# Altium schematic sheet Sheet1.SchDoc
size A4
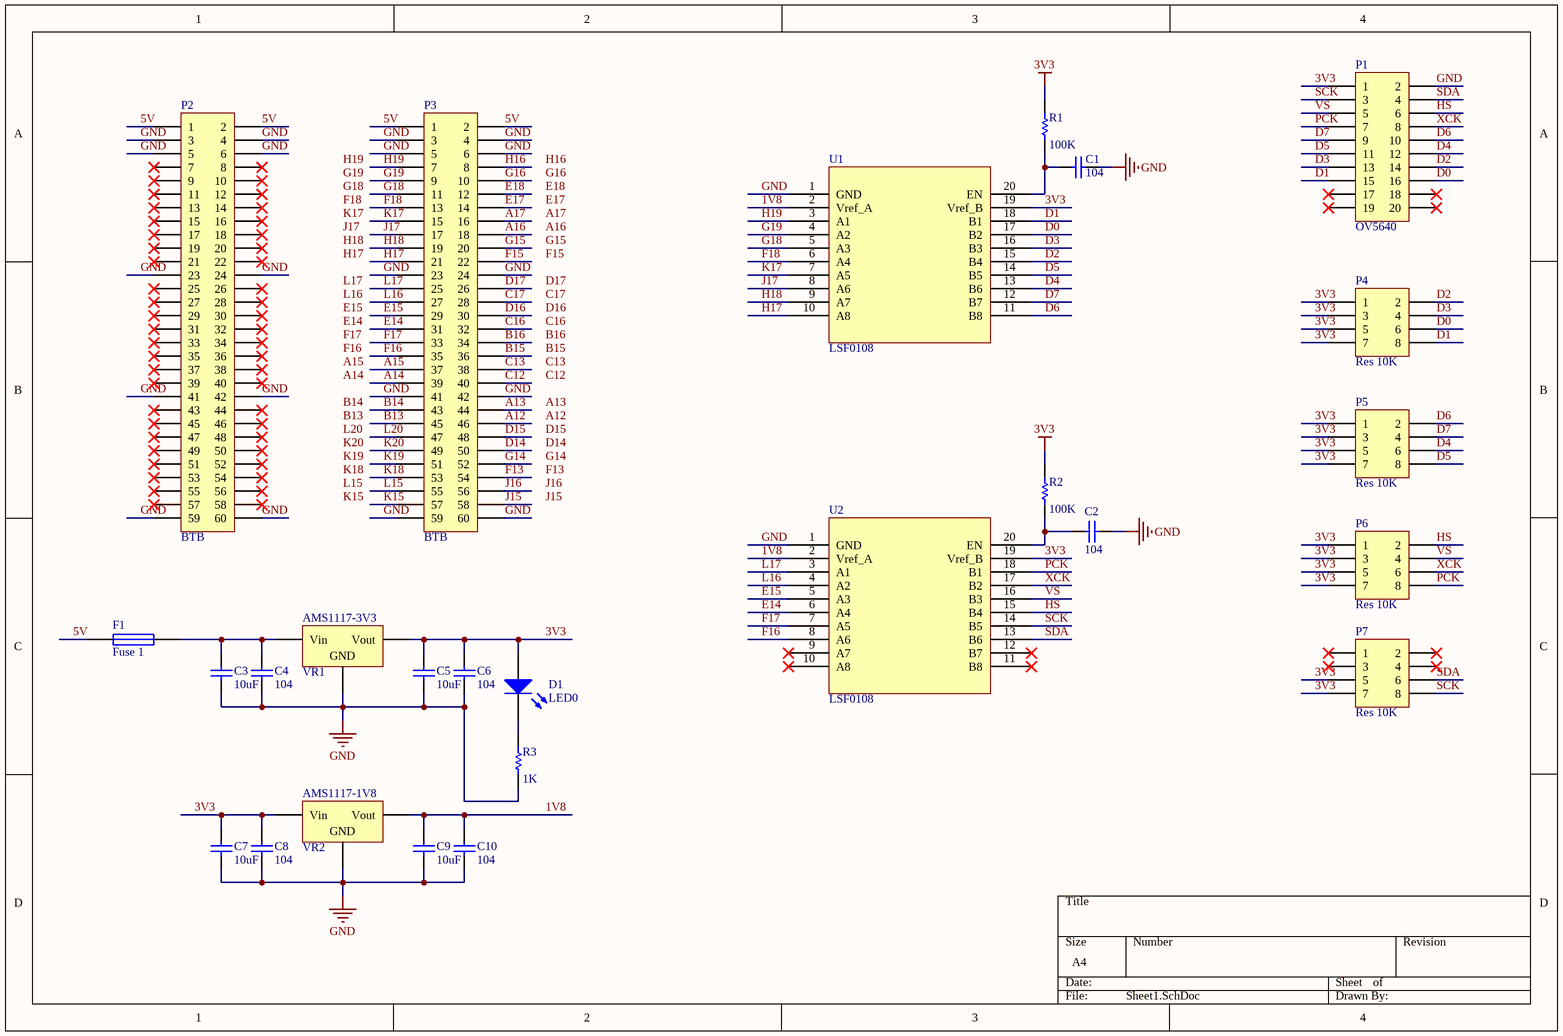
[diagram p0: Sheet1.SchDoc]

## Parts
C1  value 104  [R0805]  (hidden comment: Cap)
C2  value 104  [R0805]  (hidden comment: Cap)
C3  value 10uF  [R0805]  (hidden comment: Cap)
C4  value 104  [R0805]  (hidden comment: Cap)
C5  value 10uF  [R0805]  (hidden comment: Cap)
C6  value 104  [R0805]  (hidden comment: Cap)
C7  value 10uF  [R0805]  (hidden comment: Cap)
C8  value 104  [R0805]  (hidden comment: Cap)
C9  value 10uF  [R0805]  (hidden comment: Cap)
C10  value 104  [R0805]  (hidden comment: Cap)
D1  LED0  [LED0805红]
F1  Fuse 1  [R0805]
P1  OV5640  [HDR2X10]
P2  BTB  [BTBCON_0.8mm_60P]
P3  BTB  [BTBCON_0.8mm_60P]
P4  Res 10K  [排阻(4位贴片)]
P5  Res 10K  [排阻(4位贴片)]
P6  Res 10K  [排阻(4位贴片)]
P7  Res 10K  [排阻(4位贴片)]
R1  value 100K  [R0805]  (hidden comment: Res Semi)
R2  value 100K  [R0805]  (hidden comment: Res Semi)
R3  value 1K  [R0805]  (hidden comment: Res1)
U1  LSF0108  [TSSOP20 74lvc245]
U2  LSF0108  [TSSOP20 74lvc245]
VR1  AMS1117-3V3  [SOT-223]
VR2  AMS1117-1V8  [SOT-223]

## Nets
3V3: C5.2 C6.2 C7.2 C8.2 D1.1(A) P1.1 P4.1 P4.3 P4.5 P4.7 P5.1 P5.3 P5.5 P5.7 P6.1 P6.3 P6.5 P6.7 P7.5 P7.7 R1.2 R2.2 U1.19(Vref_B) U2.19(Vref_B) VR1.2(Vout) VR2.3(Vin)
GND: C1.2 C2.1 C3.1 C4.1 C5.1 C6.1 C7.1 C8.1 C9.1 C10.1 P1.2 P2.3 P2.4 P2.5 P2.6 P2.23 P2.24 P2.41 P2.42 P2.59 P2.60 P3.3 P3.4 P3.5 P3.6 P3.23 P3.24 P3.41 P3.42 P3.59 P3.60 R3.1 U1.1(GND) U2.1(GND) VR1.1(GND) VR2.1(GND)
1V8: C9.2 C10.2 U1.2(Vref_A) U2.2(Vref_A) VR2.2(Vout)
5V: F1.1 P2.1 P2.2 P3.1 P3.2
A12: P3.46
A13: P3.44
A14: P3.39
A15: P3.37
A16: P3.18
A17: P3.16
B13: P3.45
B14: P3.43
B15: P3.36
B16: P3.34
C12: P3.40
C13: P3.38
C16: P3.32
C17: P3.28
D0: P1.16 P4.6 U1.17(B2)
D1: P1.15 P4.8 U1.18(B1)
D2: P1.14 P4.2 U1.15(B4)
D3: P1.13 P4.4 U1.16(B3)
D4: P1.12 P5.6 U1.13(B6)
D5: P1.11 P5.8 U1.14(B5)
D6: P1.10 P5.2 U1.11(B8)
D7: P1.9 P5.4 U1.12(B7)
D14: P3.50
D15: P3.48
D16: P3.30
D17: P3.26
E14: P3.31 U2.6(A4)
E15: P3.29 U2.5(A3)
E17: P3.14
E18: P3.12
F13: P3.54
F15: P3.22
F16: P3.35 U2.8(A6)
F17: P3.33 U2.7(A5)
F18: P3.13 U1.6(A4)
G14: P3.52
G15: P3.20
G16: P3.10
G18: P3.11 U1.5(A3)
G19: P3.9 U1.4(A2)
H16: P3.8
H17: P3.21 U1.10(A8)
H18: P3.19 U1.9(A7)
H19: P3.7 U1.3(A1)
HS: P1.6 P6.2 U2.15(B4)
J15: P3.58
J16: P3.56
J17: P3.17 U1.8(A6)
K15: P3.57
K17: P3.15 U1.7(A5)
K18: P3.53
K19: P3.51
K20: P3.49
L15: P3.55
L16: P3.27 U2.4(A2)
L17: P3.25 U2.3(A1)
L20: P3.47
PCK: P1.7 P6.8 U2.18(B1)
SCK: P1.3 P7.8 U2.14(B5)
SDA: P1.4 P7.6 U2.13(B6)
VS: P1.5 P6.4 U2.16(B3)
XCK: P1.8 P6.6 U2.17(B2)
NetC1_1: C1.1 R1.1 U1.20(EN)
NetC2_2: C2.2 R2.1 U2.20(EN)
NetC3_2: C3.2 C4.2 F1.2 VR1.3(Vin)
NetD1_2: D1.2(K) R3.2

Not connected (* = marked no-connect by the designer): P1 17* 18* 19* 20*; P2 7* 8* 9* 10* 11* 12* 13* 14* 15* 16* 17* 18* 19* 20* 21* 22* 25* 26* 27* 28* 29* 30* 31* 32* 33* 34* 35* 36* 37* 38* 39* 40* 43* 44* 45* 46* 47* 48* 49* 50* 51* 52* 53* 54* 55* 56* 57* 58*; P7 1* 2* 3* 4*; U2 9(A7)* 10(A8)* 11(B8)* 12(B7)*

## Notes on the sheet
- Labels drawn without touching a wire or pin: A12, A13, A14, A15, A16, A17, B13, B14, B15, B16, C12, C13, C16, C17, D14, D15, D16, D17, E14, E15, E17, E18, F13, F15, F16, F17, F18, G14, G15, G16, G18, G19, H16, H17, H18, H19, J15, J16, J17, K15, K17, K18, K19, K20, L15, L16, L17, L20

## Library data of the parts
C1-C10 = Cap: Capacitor; Published: 8-Jun-2000; LatestRevisionDate: 17-Jul-2002; LatestRevisionNote: Re-released for DXP Platform.; PackageReference: RAD-0.3; Publisher: Altium Limited; PackageDescription: Radial Cap, Thru-Hole; 2 Leads; 0.3 in Pin Spacing
D1 = LED0: Typical INFRARED GaAs LED; Published: 8-Jun-2000; LatestRevisionDate: 08-Jul-2005; LatestRevisionNote: Mech Layer 1 removed.; PackageReference: LED-0; Publisher: Altium Limited; PackageDescription: LED; 2 Leads
F1 = Fuse 1: Fuse; Published: 8-Jun-2000; LatestRevisionDate: 17-Jul-2002; LatestRevisionNote: Re-released for DXP Platform.; PackageReference: PIN-W2/E2.8; Publisher: Altium Limited; PackageDescription: Thru-Hole; 2 Leads
P1 = Header 10X2: Header, 10-Pin, Dual row; LatestRevisionDate: 17-Jul-2002; LatestRevisionNote: Re-released for DXP Platform.; Publisher: Altium Limited
P2 P3 = Header 30X2: Header, 30-Pin, Dual row; LatestRevisionDate: 17-Jul-2002; LatestRevisionNote: Re-released for DXP Platform.; Publisher: Altium Limited
P4-P7 = Header 4X2: Header, 4-Pin, Dual row; LatestRevisionDate: 17-Jul-2002; LatestRevisionNote: Re-released for DXP Platform.; Publisher: Altium Limited
R1 R2 = Res Semi: Semiconductor Resistor; Published: 8-Jun-2000; LatestRevisionDate: 17-Jul-2002; LatestRevisionNote: Re-released for DXP Platform.; PackageReference: AXIAL-0.5; Publisher: Altium Limited; PackageDescription: Axial Device, Thru-Hole; 2 Leads; 0.5 in Pin Spacing
R3 = Res1: Resistor; Published: 8-Jun-2000; LatestRevisionDate: 17-Jul-2002; LatestRevisionNote: Re-released for DXP Platform.; PackageReference: AXIAL-0.3; Publisher: Altium Limited; PackageDescription: Axial Device, Thru-Hole; 2 Leads; 0.3 in Pin Spacing
VR1 VR2 = Volt Reg: Voltage Regulator; Published: 24-Mar-1999; LatestRevisionDate: 29-May-2009; LatestRevisionNote: IPC-7351 Footprint Added.; PackageReference: D2PAK; Publisher: Altium Limited; PackageDescription: 3-Pin Transistor Outline Package 2.54 mm Pitch, 15.1 mm Lead Span